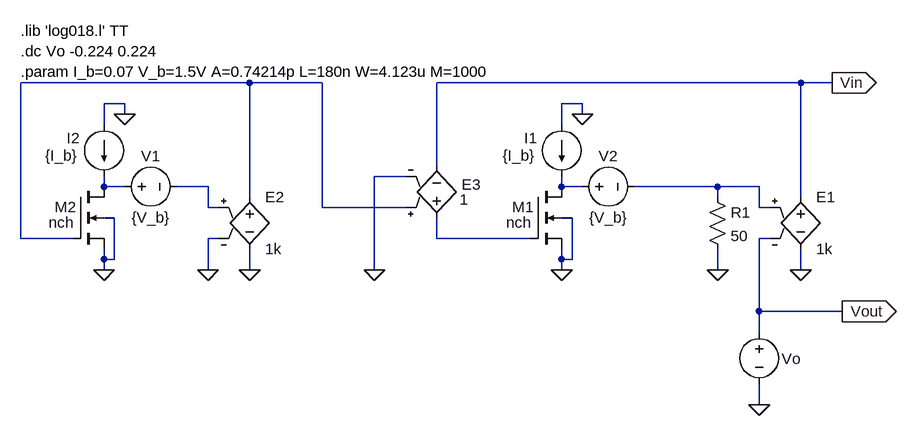
[diagram p0: schematic DualFB_distortion.asc]
DualFB_distortion.asc, the LTspice schematic file:
Version 4
SHEET 1 1012 752
WIRE 0 240 -352 240
WIRE 112 240 0 240
WIRE 848 240 288 240
WIRE 896 240 848 240
WIRE -192 272 -224 272
WIRE 512 272 480 272
WIRE -192 288 -192 272
WIRE 512 288 512 272
WIRE -224 304 -224 272
WIRE 480 304 480 272
WIRE 288 368 288 240
WIRE 240 384 192 384
WIRE -224 400 -224 384
WIRE -192 400 -224 400
WIRE -64 400 -112 400
WIRE 480 400 480 384
WIRE 512 400 480 400
WIRE 720 400 592 400
WIRE 784 400 720 400
WIRE 0 416 0 240
WIRE 720 416 720 400
WIRE 848 416 848 240
WIRE -64 432 -64 400
WIRE -48 432 -64 432
WIRE 112 432 112 240
WIRE 240 432 112 432
WIRE 784 432 784 400
WIRE 800 432 784 432
WIRE -208 448 -224 448
WIRE 496 448 480 448
WIRE -352 480 -352 240
WIRE -272 480 -352 480
WIRE -48 480 -64 480
WIRE 288 480 288 448
WIRE 432 480 288 480
WIRE 800 480 784 480
WIRE -224 512 -224 496
WIRE -208 512 -208 448
WIRE -208 512 -224 512
WIRE 480 512 480 496
WIRE 496 512 496 448
WIRE 496 512 480 512
WIRE -224 528 -224 512
WIRE -64 528 -64 480
WIRE 0 528 0 496
WIRE 192 528 192 384
WIRE 480 528 480 512
WIRE 720 528 720 496
WIRE 848 528 848 496
WIRE 784 592 784 480
WIRE 912 592 784 592
WIRE 784 624 784 592
WIRE 784 736 784 704
FLAG 480 528 0
FLAG 848 528 0
FLAG 512 288 0
FLAG 720 528 0
FLAG 784 736 0
FLAG -224 528 0
FLAG 0 528 0
FLAG -192 288 0
FLAG -64 528 0
FLAG 192 528 0
FLAG 912 592 Vout
IOPIN 912 592 Out
FLAG 896 240 Vin
IOPIN 896 240 Out
SYMBOL nmos4 432 400 R0
WINDOW 0 6 31 Right 2
WINDOW 3 2 55 Right 2
SYMATTR InstName M1
SYMATTR Value nch
SYMATTR Value2 l={L} w={A/L} m={M}
SYMBOL e 848 400 R0
SYMATTR InstName E1
SYMATTR Value 1k
SYMBOL res 704 400 R0
WINDOW 0 36 40 Left 2
WINDOW 3 36 76 Left 2
SYMATTR InstName R1
SYMATTR Value 50
SYMBOL voltage 784 608 R0
WINDOW 0 35 57 Left 2
SYMATTR InstName Vo
SYMATTR Value ""
SYMBOL current 480 304 M0
WINDOW 0 37 21 Left 2
WINDOW 3 40 48 Left 2
SYMATTR InstName I1
SYMATTR Value {I_b}
SYMBOL voltage 496 400 R270
WINDOW 0 32 56 VTop 2
WINDOW 3 -32 56 VBottom 2
SYMATTR InstName V2
SYMATTR Value {V_b}
SYMBOL nmos4 -272 400 R0
WINDOW 0 6 31 Right 2
WINDOW 3 2 55 Right 2
SYMATTR InstName M2
SYMATTR Value nch
SYMATTR Value2 l={L} w={A/L} m={M}
SYMBOL e 0 400 R0
SYMATTR InstName E2
SYMATTR Value 1k
SYMBOL current -224 304 M0
WINDOW 0 37 21 Left 2
WINDOW 3 40 48 Left 2
SYMATTR InstName I2
SYMATTR Value {I_b}
SYMBOL voltage -208 400 R270
WINDOW 0 32 56 VTop 2
WINDOW 3 -32 56 VBottom 2
SYMATTR InstName V1
SYMATTR Value {V_b}
SYMBOL e 288 464 M180
WINDOW 0 38 67 Left 2
WINDOW 3 35 44 Left 2
SYMATTR InstName E3
SYMATTR Value 1
TEXT -352 160 Left 2 !.lib 'log018.l' TT\n.dc Vo -0.224 0.224\n.param I_b=0.07 V_b=1.5V A=0.74214p L=180n W=4.123u M=1000

The netlist it stands for:
* DualFB_distortion.asc
M1 N004 N006 0 0 nch l={L} w={A/L} m={M}
E1 Vin 0 N005 Vout 1k
R1 N005 0 50
Vo Vout 0
I1 0 N004 {I_b}
V2 N004 N005 {V_b}
M2 N002 N001 0 0 nch l={L} w={A/L} m={M}
E2 N001 0 N003 0 1k
I2 0 N002 {I_b}
V1 N002 N003 {V_b}
E3 N006 Vin N001 0 1
.model NMOS NMOS
.model PMOS PMOS
.lib standard.mos
.lib 'log018.l' TT
.dc Vo -0.224 0.224
.param I_b=0.07 V_b=1.5V A=0.74214p L=180n W=4.123u M=1000
.backanno
.end

* Results of the author's LTspice run, read from the files saved beside the schematic
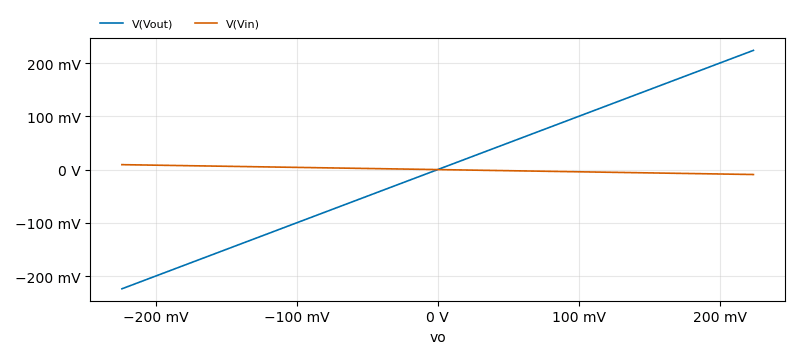
[diagram p1: DC transfer characteristic of DualFB_distortion.asc, plotted from the saved traces]
* DC transfer characteristic, 1 run:
*   V(Vout): -224 mV at vo=-224 mV, 224 mV at vo=224 mV, min -224 mV, max 224 mV
*   V(Vin): 9.261 mV at vo=-224 mV, -9.267 mV at vo=224 mV, min -9.267 mV, max 9.261 mV